# Altium schematic sheet Top.SchDoc: STM32F723e Discovery Interconnexion
size A4; Author: N.P; CompanyName: STMicroelectronics; Organization: MCD/APPLIS/LMS; DocumentNumber: MB1260; SheetNumber: 2; SheetTotal: 13; Project: STM32F723e-DISCO
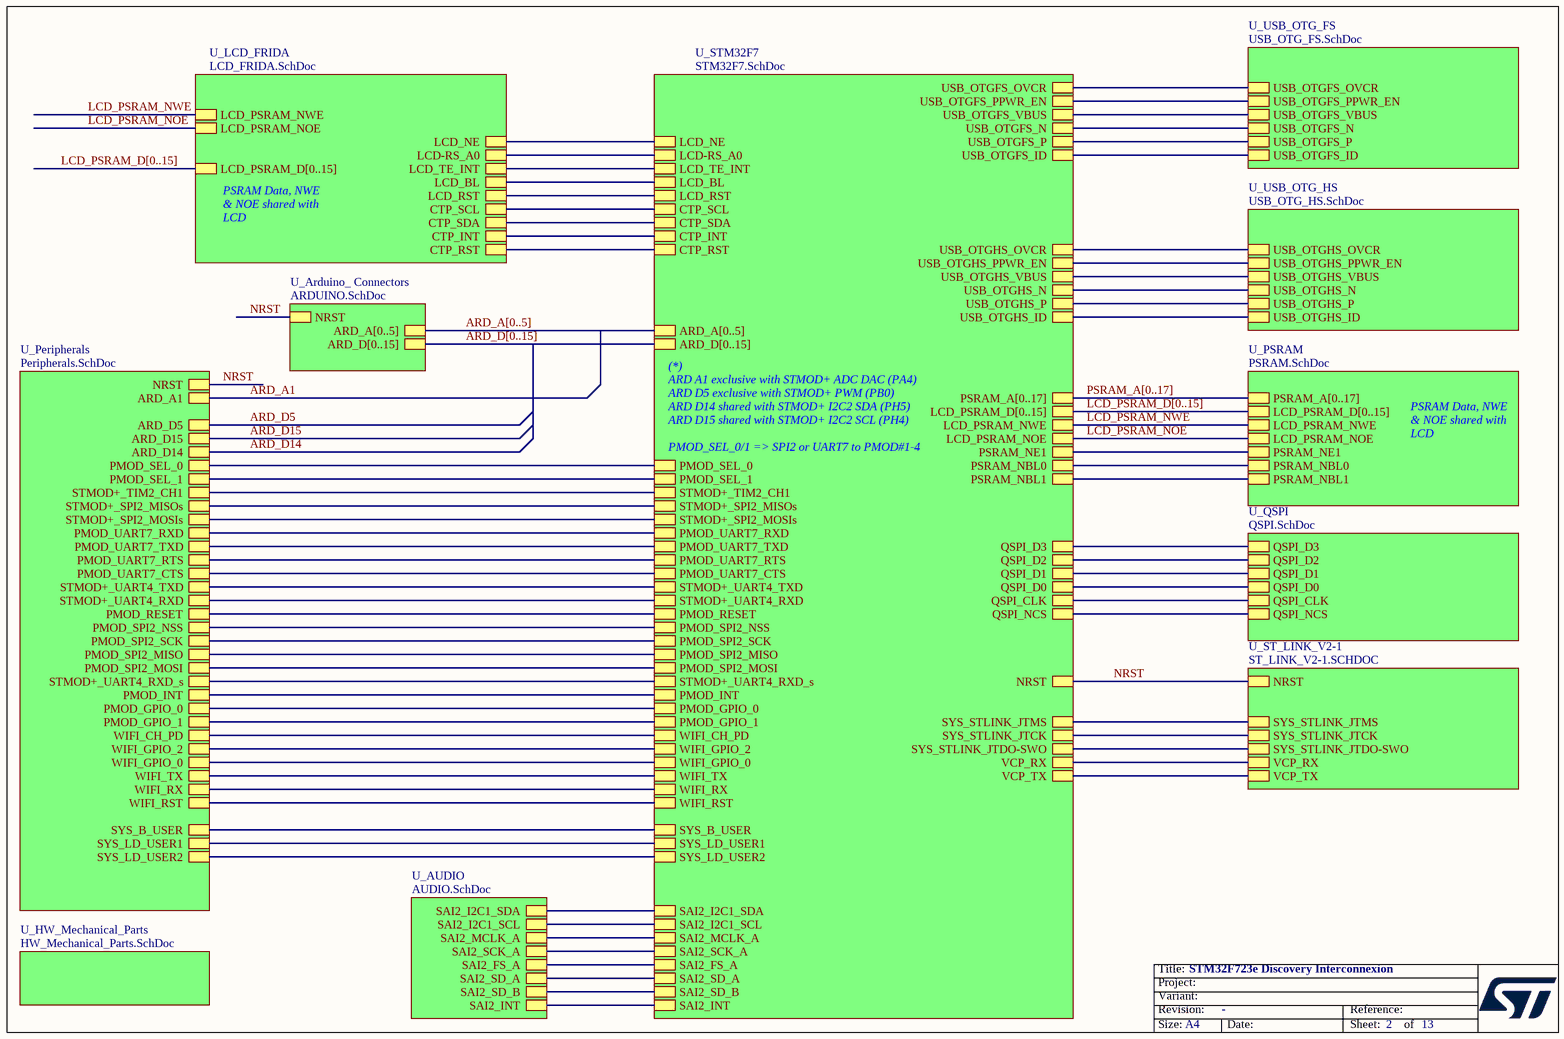
[diagram p0: Top.SchDoc]

## Sub-sheets
U_Arduino_ Connectors = ARDUINO.SchDoc: NRST, ARD_D[0..15], ARD_A[0..5]
U_AUDIO = AUDIO.SchDoc: SAI2_I2C1_SDA, SAI2_I2C1_SCL, SAI2_MCLK_A, SAI2_SCK_A, SAI2_FS_A, SAI2_SD_A, SAI2_SD_B, SAI2_INT
U_HW_Mechanical_Parts = HW_Mechanical_Parts.SchDoc: no entries
U_LCD_FRIDA = LCD_FRIDA.SchDoc: LCD_NE, LCD_TE_INT, LCD_BL, LCD_RST, CTP_SCL, CTP_SDA, CTP_INT, CTP_RST, LCD_PSRAM_D[0..15], LCD_PSRAM_NWE, LCD_PSRAM_NOE, LCD-RS_A0
U_Peripherals = Peripherals.SchDoc: NRST, WIFI_TX, WIFI_RX, WIFI_RST, STMOD+_TIM2_CH1, STMOD+_SPI2_MOSIs, PMOD_UART7_RXD, PMOD_UART7_TXD, PMOD_UART7_CTS, PMOD_UART7_RTS, STMOD+_UART4_TXD, STMOD+_UART4_RXD, PMOD_RESET, PMOD_SPI2_SCK, PMOD_SPI2_NSS, PMOD_SPI2_MISO, PMOD_SPI2_MOSI, STMOD+_UART4_RXD_s, PMOD_INT, SYS_B_USER, SYS_LD_USER1, SYS_LD_USER2, ARD_D15, ARD_D14, ARD_A1, ARD_D5, PMOD_GPIO_1, PMOD_GPIO_0, WIFI_GPIO_0, WIFI_GPIO_2, WIFI_CH_PD, PMOD_SEL_1, STMOD+_SPI2_MISOs, PMOD_SEL_0
U_PSRAM = PSRAM.SchDoc: PSRAM_A[0..17], LCD_PSRAM_D[0..15], LCD_PSRAM_NWE, PSRAM_NE1, PSRAM_NBL0, PSRAM_NBL1, LCD_PSRAM_NOE
U_QSPI = QSPI.SchDoc: QSPI_D0, QSPI_D3, QSPI_D1, QSPI_CLK, QSPI_NCS, QSPI_D2
U_ST_LINK_V2-1 = ST_LINK_V2-1.SCHDOC: SYS_STLINK_JTMS, SYS_STLINK_JTCK, SYS_STLINK_JTDO-SWO, VCP_RX, VCP_TX, NRST
U_STM32F7 = STM32F7.SchDoc: QSPI_D0, QSPI_D3, QSPI_D1, QSPI_CLK, QSPI_NCS, SAI2_I2C1_SDA, SAI2_I2C1_SCL, SAI2_MCLK_A, CTP_SCL, CTP_SDA, PSRAM_A[0..17], LCD_PSRAM_D[0..15], LCD_PSRAM_NWE, PSRAM_NE1, PSRAM_NBL0, PSRAM_NBL1, QSPI_D2, ARD_D[0..15], SAI2_SCK_A, SAI2_FS_A, SAI2_SD_A, SAI2_SD_B, SAI2_INT, LCD_NE, LCD_TE_INT, LCD_BL, LCD_RST, CTP_INT, CTP_RST, WIFI_RST, WIFI_RX, WIFI_TX, ARD_A[0..5], LCD_PSRAM_NOE, SYS_STLINK_JTMS, SYS_STLINK_JTCK, SYS_STLINK_JTDO-SWO, VCP_RX, VCP_TX, USB_OTGHS_OVCR, USB_OTGHS_PPWR_EN, USB_OTGHS_VBUS, USB_OTGHS_N, USB_OTGHS_ID, USB_OTGHS_P, USB_OTGFS_OVCR, USB_OTGFS_PPWR_EN, USB_OTGFS_VBUS, USB_OTGFS_P, USB_OTGFS_N, USB_OTGFS_ID, STMOD+_TIM2_CH1, STMOD+_SPI2_MOSIs, PMOD_UART7_RXD, PMOD_UART7_TXD, PMOD_UART7_CTS, PMOD_UART7_RTS, STMOD+_UART4_TXD, STMOD+_UART4_RXD, PMOD_RESET, PMOD_SPI2_SCK, PMOD_SPI2_NSS, PMOD_SPI2_MISO, PMOD_SPI2_MOSI, STMOD+_UART4_RXD_s, PMOD_INT, NRST, SYS_B_USER, SYS_LD_USER1, SYS_LD_USER2, PMOD_GPIO_0, PMOD_GPIO_1, WIFI_GPIO_0, WIFI_GPIO_2, WIFI_CH_PD, LCD-RS_A0, PMOD_SEL_1, STMOD+_SPI2_MISOs, PMOD_SEL_0
U_USB_OTG_FS = USB_OTG_FS.SchDoc: USB_OTGFS_OVCR, USB_OTGFS_PPWR_EN, USB_OTGFS_VBUS, USB_OTGFS_P, USB_OTGFS_N, USB_OTGFS_ID
U_USB_OTG_HS = USB_OTG_HS.SchDoc: USB_OTGHS_OVCR, USB_OTGHS_PPWR_EN, USB_OTGHS_VBUS, USB_OTGHS_N, USB_OTGHS_ID, USB_OTGHS_P

## Nets
ARD_A1: sheet U_Peripherals/ARD_A1
ARD_D5: sheet U_Peripherals/ARD_D5
ARD_D14: sheet U_Peripherals/ARD_D14
ARD_D15: sheet U_Peripherals/ARD_D15
LCD_PSRAM_NOE: sheet U_PSRAM/LCD_PSRAM_NOE, sheet U_STM32F7/LCD_PSRAM_NOE, sheet U_LCD_FRIDA/LCD_PSRAM_NOE
LCD_PSRAM_NWE: sheet U_PSRAM/LCD_PSRAM_NWE, sheet U_STM32F7/LCD_PSRAM_NWE, sheet U_LCD_FRIDA/LCD_PSRAM_NWE
NRST: sheet U_ST_LINK_V2-1/NRST, sheet U_Peripherals/NRST, sheet U_Arduino_ Connectors/NRST, sheet U_STM32F7/NRST
(unnamed): sheet U_ST_LINK_V2-1/SYS_STLINK_JTMS, sheet U_STM32F7/SYS_STLINK_JTMS
(unnamed): sheet U_ST_LINK_V2-1/SYS_STLINK_JTCK, sheet U_STM32F7/SYS_STLINK_JTCK
(unnamed): sheet U_ST_LINK_V2-1/SYS_STLINK_JTDO-SWO, sheet U_STM32F7/SYS_STLINK_JTDO-SWO
(unnamed): sheet U_ST_LINK_V2-1/VCP_RX, sheet U_STM32F7/VCP_RX
(unnamed): sheet U_ST_LINK_V2-1/VCP_TX, sheet U_STM32F7/VCP_TX
(unnamed): sheet U_AUDIO/SAI2_I2C1_SDA, sheet U_STM32F7/SAI2_I2C1_SDA
(unnamed): sheet U_AUDIO/SAI2_I2C1_SCL, sheet U_STM32F7/SAI2_I2C1_SCL
(unnamed): sheet U_AUDIO/SAI2_MCLK_A, sheet U_STM32F7/SAI2_MCLK_A
(unnamed): sheet U_AUDIO/SAI2_SCK_A, sheet U_STM32F7/SAI2_SCK_A
(unnamed): sheet U_AUDIO/SAI2_FS_A, sheet U_STM32F7/SAI2_FS_A
(unnamed): sheet U_AUDIO/SAI2_SD_A, sheet U_STM32F7/SAI2_SD_A
(unnamed): sheet U_AUDIO/SAI2_SD_B, sheet U_STM32F7/SAI2_SD_B
(unnamed): sheet U_AUDIO/SAI2_INT, sheet U_STM32F7/SAI2_INT
(unnamed): sheet U_Peripherals/WIFI_TX, sheet U_STM32F7/WIFI_TX
(unnamed): sheet U_Peripherals/WIFI_RX, sheet U_STM32F7/WIFI_RX
(unnamed): sheet U_Peripherals/WIFI_RST, sheet U_STM32F7/WIFI_RST
(unnamed): sheet U_Peripherals/STMOD+_TIM2_CH1, sheet U_STM32F7/STMOD+_TIM2_CH1
(unnamed): sheet U_Peripherals/STMOD+_SPI2_MOSIs, sheet U_STM32F7/STMOD+_SPI2_MOSIs
(unnamed): sheet U_Peripherals/PMOD_UART7_RXD, sheet U_STM32F7/PMOD_UART7_RXD
(unnamed): sheet U_Peripherals/PMOD_UART7_TXD, sheet U_STM32F7/PMOD_UART7_TXD
(unnamed): sheet U_Peripherals/PMOD_UART7_CTS, sheet U_STM32F7/PMOD_UART7_CTS
(unnamed): sheet U_Peripherals/PMOD_UART7_RTS, sheet U_STM32F7/PMOD_UART7_RTS
(unnamed): sheet U_Peripherals/STMOD+_UART4_TXD, sheet U_STM32F7/STMOD+_UART4_TXD
(unnamed): sheet U_Peripherals/STMOD+_UART4_RXD, sheet U_STM32F7/STMOD+_UART4_RXD
(unnamed): sheet U_Peripherals/PMOD_RESET, sheet U_STM32F7/PMOD_RESET
(unnamed): sheet U_Peripherals/PMOD_SPI2_SCK, sheet U_STM32F7/PMOD_SPI2_SCK
(unnamed): sheet U_Peripherals/PMOD_SPI2_NSS, sheet U_STM32F7/PMOD_SPI2_NSS
(unnamed): sheet U_Peripherals/PMOD_SPI2_MISO, sheet U_STM32F7/PMOD_SPI2_MISO
(unnamed): sheet U_Peripherals/PMOD_SPI2_MOSI, sheet U_STM32F7/PMOD_SPI2_MOSI
(unnamed): sheet U_Peripherals/STMOD+_UART4_RXD_s, sheet U_STM32F7/STMOD+_UART4_RXD_s
(unnamed): sheet U_Peripherals/PMOD_INT, sheet U_STM32F7/PMOD_INT
(unnamed): sheet U_Peripherals/SYS_B_USER, sheet U_STM32F7/SYS_B_USER
(unnamed): sheet U_Peripherals/SYS_LD_USER1, sheet U_STM32F7/SYS_LD_USER1
(unnamed): sheet U_Peripherals/SYS_LD_USER2, sheet U_STM32F7/SYS_LD_USER2
(unnamed): sheet U_Peripherals/PMOD_GPIO_1, sheet U_STM32F7/PMOD_GPIO_1
(unnamed): sheet U_Peripherals/PMOD_GPIO_0, sheet U_STM32F7/PMOD_GPIO_0
(unnamed): sheet U_Peripherals/WIFI_GPIO_0, sheet U_STM32F7/WIFI_GPIO_0
(unnamed): sheet U_Peripherals/WIFI_GPIO_2, sheet U_STM32F7/WIFI_GPIO_2
(unnamed): sheet U_Peripherals/WIFI_CH_PD, sheet U_STM32F7/WIFI_CH_PD
(unnamed): sheet U_Peripherals/PMOD_SEL_1, sheet U_STM32F7/PMOD_SEL_1
(unnamed): sheet U_Peripherals/STMOD+_SPI2_MISOs, sheet U_STM32F7/STMOD+_SPI2_MISOs
(unnamed): sheet U_Peripherals/PMOD_SEL_0, sheet U_STM32F7/PMOD_SEL_0
(unnamed): sheet U_PSRAM/PSRAM_NE1, sheet U_STM32F7/PSRAM_NE1
(unnamed): sheet U_PSRAM/PSRAM_NBL0, sheet U_STM32F7/PSRAM_NBL0
(unnamed): sheet U_PSRAM/PSRAM_NBL1, sheet U_STM32F7/PSRAM_NBL1
(unnamed): sheet U_USB_OTG_FS/USB_OTGFS_OVCR, sheet U_STM32F7/USB_OTGFS_OVCR
(unnamed): sheet U_USB_OTG_FS/USB_OTGFS_PPWR_EN, sheet U_STM32F7/USB_OTGFS_PPWR_EN
(unnamed): sheet U_USB_OTG_FS/USB_OTGFS_VBUS, sheet U_STM32F7/USB_OTGFS_VBUS
(unnamed): sheet U_USB_OTG_FS/USB_OTGFS_P, sheet U_STM32F7/USB_OTGFS_P
(unnamed): sheet U_USB_OTG_FS/USB_OTGFS_N, sheet U_STM32F7/USB_OTGFS_N
(unnamed): sheet U_USB_OTG_FS/USB_OTGFS_ID, sheet U_STM32F7/USB_OTGFS_ID
(unnamed): sheet U_STM32F7/QSPI_D0, sheet U_QSPI/QSPI_D0
(unnamed): sheet U_STM32F7/QSPI_D3, sheet U_QSPI/QSPI_D3
(unnamed): sheet U_STM32F7/QSPI_D1, sheet U_QSPI/QSPI_D1
(unnamed): sheet U_STM32F7/QSPI_CLK, sheet U_QSPI/QSPI_CLK
(unnamed): sheet U_STM32F7/QSPI_NCS, sheet U_QSPI/QSPI_NCS
(unnamed): sheet U_STM32F7/CTP_SCL, sheet U_LCD_FRIDA/CTP_SCL
(unnamed): sheet U_STM32F7/CTP_SDA, sheet U_LCD_FRIDA/CTP_SDA
(unnamed): sheet U_STM32F7/QSPI_D2, sheet U_QSPI/QSPI_D2
(unnamed): sheet U_STM32F7/LCD_NE, sheet U_LCD_FRIDA/LCD_NE
(unnamed): sheet U_STM32F7/LCD_TE_INT, sheet U_LCD_FRIDA/LCD_TE_INT
(unnamed): sheet U_STM32F7/LCD_BL, sheet U_LCD_FRIDA/LCD_BL
(unnamed): sheet U_STM32F7/LCD_RST, sheet U_LCD_FRIDA/LCD_RST
(unnamed): sheet U_STM32F7/CTP_INT, sheet U_LCD_FRIDA/CTP_INT
(unnamed): sheet U_STM32F7/CTP_RST, sheet U_LCD_FRIDA/CTP_RST
(unnamed): sheet U_STM32F7/USB_OTGHS_OVCR, sheet U_USB_OTG_HS/USB_OTGHS_OVCR
(unnamed): sheet U_STM32F7/USB_OTGHS_PPWR_EN, sheet U_USB_OTG_HS/USB_OTGHS_PPWR_EN
(unnamed): sheet U_STM32F7/USB_OTGHS_VBUS, sheet U_USB_OTG_HS/USB_OTGHS_VBUS
(unnamed): sheet U_STM32F7/USB_OTGHS_N, sheet U_USB_OTG_HS/USB_OTGHS_N
(unnamed): sheet U_STM32F7/USB_OTGHS_ID, sheet U_USB_OTG_HS/USB_OTGHS_ID
(unnamed): sheet U_STM32F7/USB_OTGHS_P, sheet U_USB_OTG_HS/USB_OTGHS_P
(unnamed): sheet U_STM32F7/LCD-RS_A0, sheet U_LCD_FRIDA/LCD-RS_A0

## Buses and harness runs
bus ARD_A[0..5] = sheet U_Arduino_ Connectors/ARD_A[0..5] = sheet U_STM32F7/ARD_A[0..5]
bus ARD_D[0..15] = sheet U_Arduino_ Connectors/ARD_D[0..15] = sheet U_STM32F7/ARD_D[0..15]
bus LCD_PSRAM_D[0..15] = sheet U_LCD_FRIDA/LCD_PSRAM_D[0..15]
bus LCD_PSRAM_D[0..15] = sheet U_PSRAM/LCD_PSRAM_D[0..15] = sheet U_STM32F7/LCD_PSRAM_D[0..15]
bus PSRAM_A[0..17] = sheet U_PSRAM/PSRAM_A[0..17] = sheet U_STM32F7/PSRAM_A[0..17]

## Notes on the sheet
- PSRAM Data, NWE & NOE shared with LCD
- (*)
  ARD A1 exclusive with STMOD+ ADC DAC (PA4)
  ARD D5 exclusive with STMOD+ PWM (PB0)
  ARD D14 shared with STMOD+ I2C2 SDA (PH5)
  ARD D15 shared with STMOD+ I2C2 SCL (PH4)
- PMOD_SEL_0/1 => SPI2 or UART7 to PMOD#1-4
- Title:
- Project:
- Size:
- Revision:
- Variant:
- A4
- -
- Date:
- Reference:
- Sheet:
- of